# EAGLE design elysium_v0_8 (EAGLE 6.5.0)
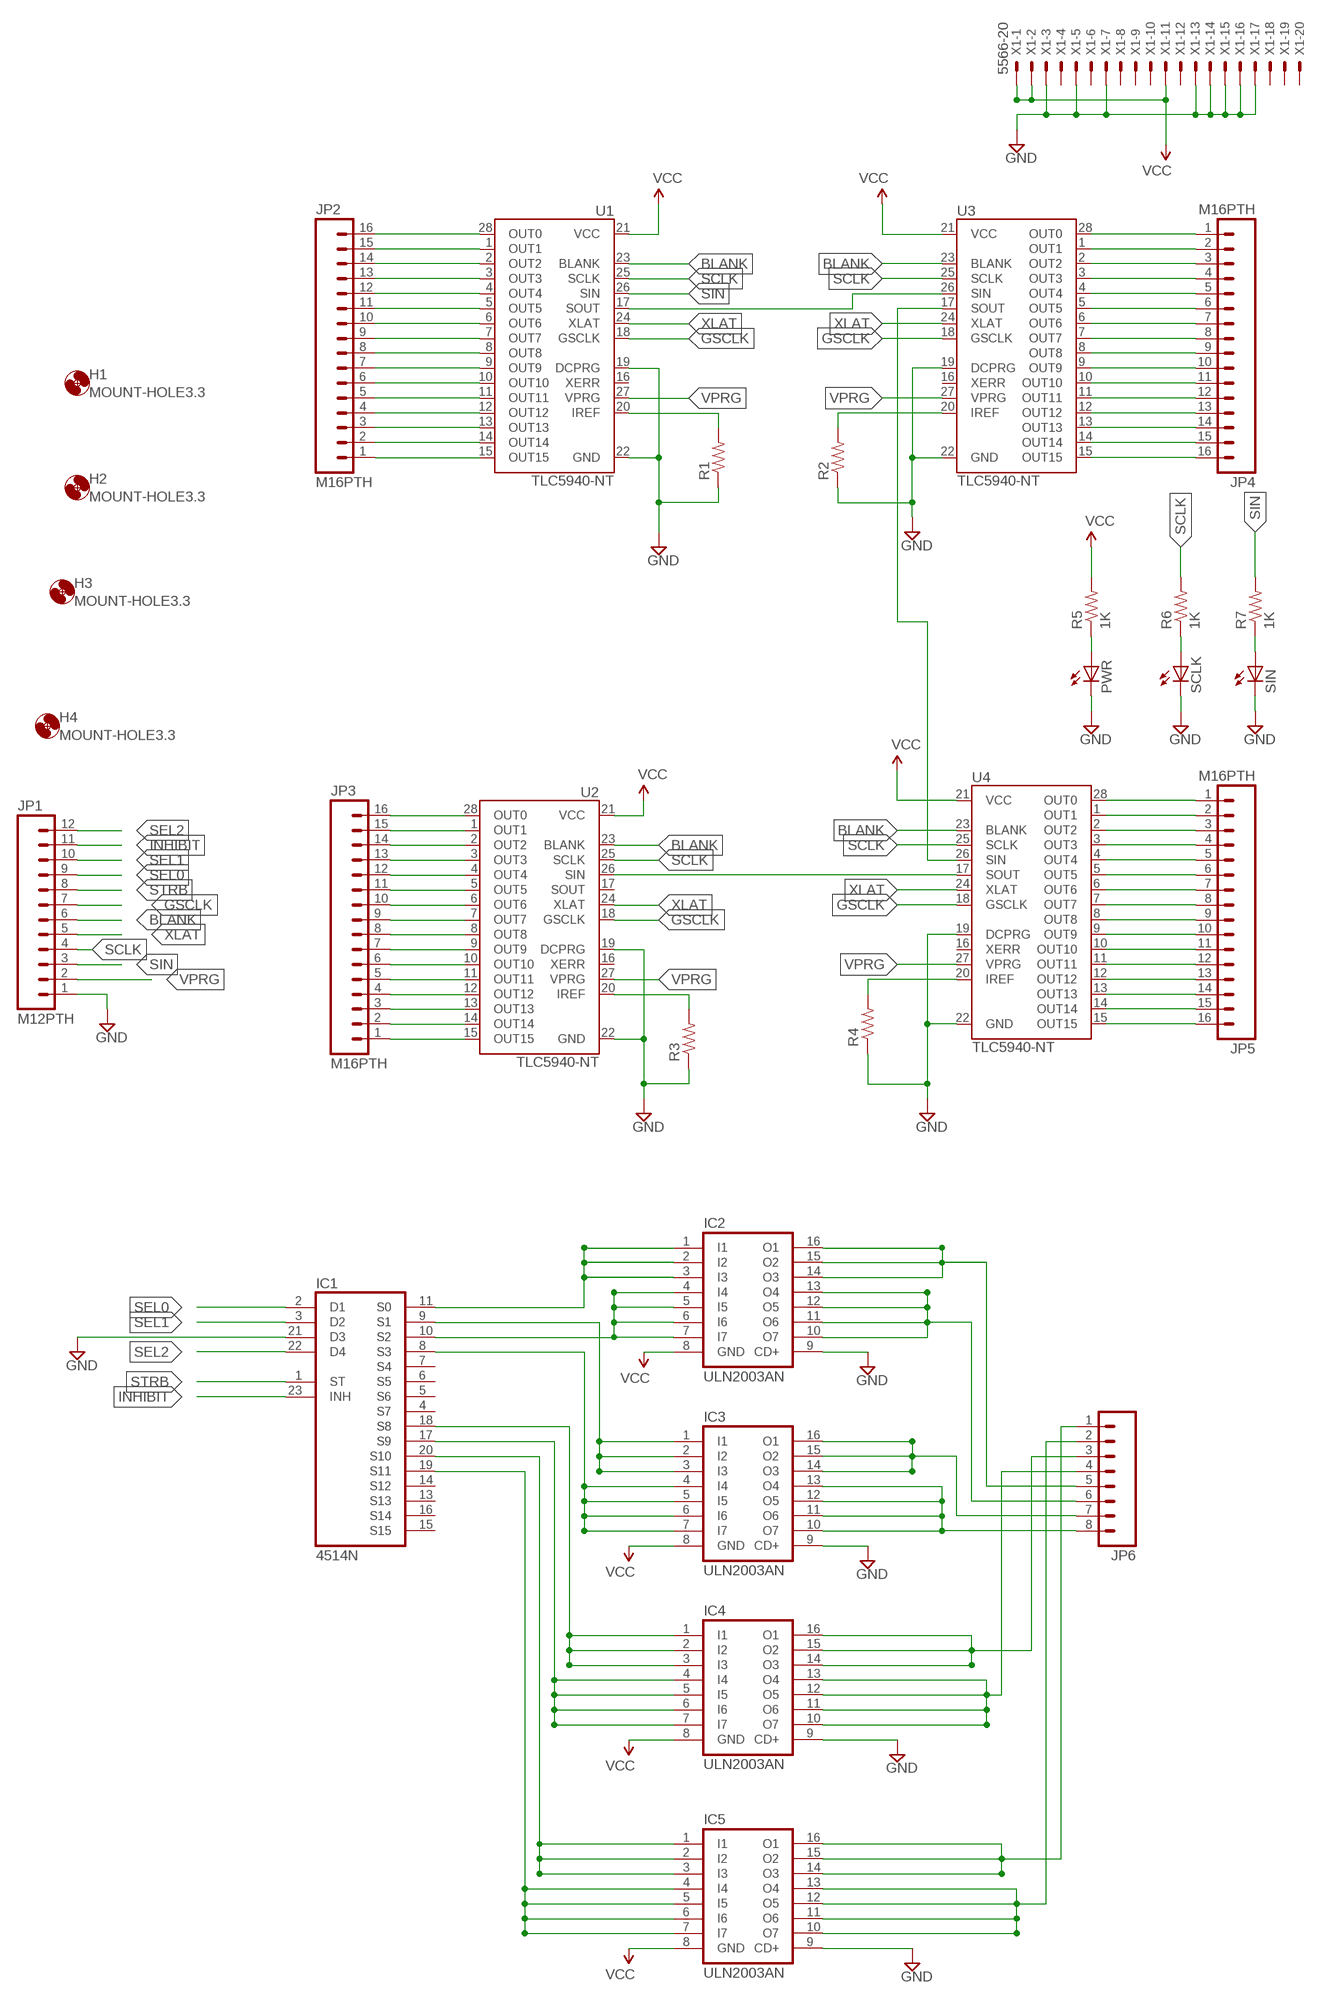
[diagram p0: schematic, sheet 1]

## Parts
H1  MOUNT-HOLE3.3  [3,3]
H2  MOUNT-HOLE3.3  [3,3]
H3  MOUNT-HOLE3.3  [3,3]
H4  MOUNT-HOLE3.3  [3,3]
IC1  4514N  [DIL24-6]
IC2  ULN2003AN  [DIL16]
IC3  ULN2003AN  [DIL16]
IC4  ULN2003AN  [DIL16]
IC5  ULN2003AN  [DIL16]
JP1  M12PTH  [1X12]
JP2  M16PTH  [1X16]
JP3  M16PTH  [1X16]
JP4  M16PTH  [1X16]
JP5  M16PTH  [1X16]
JP6  M081X08  [1X08]
PWR  LED5MM  [LED5MM]
R1  RESISTOREZ  [AXIAL-0.3EZ]
R2  RESISTOREZ  [AXIAL-0.3EZ]
R3  RESISTOREZ  [AXIAL-0.3EZ]
R4  RESISTOREZ  [AXIAL-0.3EZ]
R5  1K  RESISTOREZ  [AXIAL-0.3EZ]
R6  1K  RESISTOREZ  [AXIAL-0.3EZ]
R7  1K  RESISTOREZ  [AXIAL-0.3EZ]
SCLK  LED5MM  [LED5MM]
SIN  LED5MM  [LED5MM]
U1  TLC5940-NT  [DIL28-3]
U2  TLC5940-NT  [DIL28-3]
U3  TLC5940-NT  [DIL28-3]
U4  TLC5940-NT  [DIL28-3]
X1  5566-20  [5566-20]

## Nets
BLANK: JP1.6 U1.23(BLANK) U2.23(BLANK) U3.23(BLANK) U4.23(BLANK)
GND: IC1.21(D3) IC2.9(CD+) IC3.9(CD+) IC4.9(CD+) IC5.9(CD+) JP1.1 PWR.K(C) R1.P$1 R2.P$1 R3.P$1 R4.P$1 SCLK.K(C) SIN.K(C) U1.19(DCPRG) U1.22(GND) U2.19(DCPRG) U2.22(GND) U3.19(DCPRG) U3.22(GND) U4.19(DCPRG) U4.22(GND) X1.3 X1.5 X1.7 X1.13 X1.14 X1.15 X1.16 X1.17
GSCLK: JP1.7 U1.18(GSCLK) U2.18(GSCLK) U3.18(GSCLK) U4.18(GSCLK)
INHIBIT: IC1.23(INH) JP1.11
N$1: JP2.16 U1.28(OUT0)
N$2: JP2.15 U1.1(OUT1)
N$3: JP2.14 U1.2(OUT2)
N$4: JP2.13 U1.3(OUT3)
N$5: JP2.12 U1.4(OUT4)
N$6: JP2.11 U1.5(OUT5)
N$7: JP2.10 U1.6(OUT6)
N$8: JP2.9 U1.7(OUT7)
N$9: JP2.8 U1.8(OUT8)
N$10: JP2.7 U1.9(OUT9)
N$11: JP2.6 U1.10(OUT10)
N$12: JP2.5 U1.11(OUT11)
N$13: JP2.4 U1.12(OUT12)
N$14: JP2.3 U1.13(OUT13)
N$15: JP2.2 U1.14(OUT14)
N$16: JP2.1 U1.15(OUT15)
N$17: JP4.1 U3.28(OUT0)
N$18: JP4.2 U3.1(OUT1)
N$19: JP4.3 U3.2(OUT2)
N$20: JP4.4 U3.3(OUT3)
N$21: JP4.5 U3.4(OUT4)
N$22: JP4.6 U3.5(OUT5)
N$23: JP4.7 U3.6(OUT6)
N$24: JP4.8 U3.7(OUT7)
N$25: JP4.9 U3.8(OUT8)
N$26: JP4.10 U3.9(OUT9)
N$27: JP4.11 U3.10(OUT10)
N$28: JP4.12 U3.11(OUT11)
N$29: JP4.13 U3.12(OUT12)
N$30: JP4.14 U3.13(OUT13)
N$31: JP4.15 U3.14(OUT14)
N$32: JP4.16 U3.15(OUT15)
N$33: JP3.16 U2.28(OUT0)
N$34: JP3.15 U2.1(OUT1)
N$35: JP3.14 U2.2(OUT2)
N$36: JP3.13 U2.3(OUT3)
N$37: JP3.12 U2.4(OUT4)
N$38: JP3.11 U2.5(OUT5)
N$39: JP3.10 U2.6(OUT6)
N$40: JP3.9 U2.7(OUT7)
N$41: JP3.8 U2.8(OUT8)
N$42: JP3.7 U2.9(OUT9)
N$43: JP3.6 U2.10(OUT10)
N$44: JP3.5 U2.11(OUT11)
N$45: JP3.4 U2.12(OUT12)
N$46: JP3.3 U2.13(OUT13)
N$47: JP3.2 U2.14(OUT14)
N$48: JP3.1 U2.15(OUT15)
N$49: JP5.1 U4.28(OUT0)
N$50: JP5.2 U4.1(OUT1)
N$51: JP5.3 U4.2(OUT2)
N$52: JP5.4 U4.3(OUT3)
N$53: JP5.5 U4.4(OUT4)
N$54: JP5.6 U4.5(OUT5)
N$55: JP5.7 U4.6(OUT6)
N$56: JP5.8 U4.7(OUT7)
N$57: JP5.9 U4.8(OUT8)
N$58: JP5.10 U4.9(OUT9)
N$59: JP5.11 U4.10(OUT10)
N$60: JP5.12 U4.11(OUT11)
N$61: JP5.13 U4.12(OUT12)
N$62: JP5.14 U4.13(OUT13)
N$63: JP5.15 U4.14(OUT14)
N$64: JP5.16 U4.15(OUT15)
N$65: U1.17(SOUT) U3.26(SIN)
N$66: U3.17(SOUT) U4.26(SIN)
N$67: U2.26(SIN) U4.17(SOUT)
N$68: R1.P$2 U1.20(IREF)
N$69: PWR.A R5.P$1
N$70: R2.P$2 U3.20(IREF)
N$71: IC1.11(S0) IC2.1(I1) IC2.2(I2) IC2.3(I3)
N$73: IC1.9(S1) IC3.1(I1) IC3.2(I2) IC3.3(I3)
N$74: R6.P$1 SCLK.A
N$75: R3.P$2 U2.20(IREF)
N$76: R7.P$1 SIN.A
N$77: R4.P$2 U4.20(IREF)
N$78: IC1.10(S2) IC2.4(I4) IC2.5(I5) IC2.6(I6) IC2.7(I7)
N$79: IC1.8(S3) IC3.4(I4) IC3.5(I5) IC3.6(I6) IC3.7(I7)
N$80: IC1.18(S8) IC4.1(I1) IC4.2(I2) IC4.3(I3)
N$81: IC1.17(S9) IC4.4(I4) IC4.5(I5) IC4.6(I6) IC4.7(I7)
N$82: IC1.20(S10) IC5.1(I1) IC5.2(I2) IC5.3(I3)
N$83: IC1.19(S11) IC5.4(I4) IC5.5(I5) IC5.6(I6) IC5.7(I7)
N$84: IC2.14(O3) IC2.15(O2) IC2.16(O1) JP6.5
N$85: IC2.10(O7) IC2.11(O6) IC2.12(O5) IC2.13(O4) JP6.6
N$86: IC3.14(O3) IC3.15(O2) IC3.16(O1) JP6.7
N$87: IC3.10(O7) IC3.11(O6) IC3.12(O5) IC3.13(O4) JP6.8
N$88: IC4.14(O3) IC4.15(O2) IC4.16(O1) JP6.3
N$89: IC4.10(O7) IC4.11(O6) IC4.12(O5) IC4.13(O4) JP6.4
N$90: IC5.14(O3) IC5.15(O2) IC5.16(O1) JP6.1
N$91: IC5.10(O7) IC5.11(O6) IC5.12(O5) IC5.13(O4) JP6.2
SCLK: JP1.4 R6.P$2 U1.25(SCLK) U2.25(SCLK) U3.25(SCLK) U4.25(SCLK)
SEL0: IC1.2(D1) JP1.9
SEL1: IC1.3(D2) JP1.10
SEL2: IC1.22(D4) JP1.12
SIN: JP1.3 R7.P$2 U1.26(SIN)
STRB: IC1.1(ST) JP1.8
VCC: IC2.8(GND) IC3.8(GND) IC4.8(GND) IC5.8(GND) R5.P$2 U1.21(VCC) U2.21(VCC) U3.21(VCC) U4.21(VCC) X1.1 X1.2 X1.11
VPRG: JP1.2 U1.27(VPRG) U2.27(VPRG) U3.27(VPRG) U4.27(VPRG)
XLAT: JP1.5 U1.24(XLAT) U2.24(XLAT) U3.24(XLAT) U4.24(XLAT)
Unconnected: IC1.4(S7) IC1.5(S6) IC1.6(S5) IC1.7(S4) IC1.13(S13) IC1.14(S12) IC1.15(S15) IC1.16(S14) U1.16(XERR) U2.16(XERR) U2.17(SOUT) U3.16(XERR) U4.16(XERR) X1.4 X1.6 X1.8 X1.9 X1.10 X1.12 X1.18 X1.19 X1.20

## Power pins joined to a net without a drawn wire
GND: IC1.12(VSS)
VCC: IC1.24(VDD)

## Library data of the parts
H1-H4 = holes:MOUNT-HOLE: MOUNTING HOLE with drill center marker
IC1 = 45xx:4514: 4-bit latch 4-16 line DECODER
IC2-IC5 = uln-udn:ULN2003A: DRIVER ARRAY
JP1 = SparkFun-Connectors:M12: Header 12 Standard 12-pin 0.1" header. Use with straight break away headers (SKU : PRT-00116), right angle break away headers (PRT-00553), swiss pins (PRT-00743), machine pins (PRT-00117), and female headers (PRT-00115).
JP2-JP5 = SparkFun-Connectors:M16: 1x16 .1" header
JP6 = SparkFun-Connectors:M08: Header 8 Standard 8-pin 0.1" header. Use with straight break away headers (SKU : PRT-00116), right angle break away headers (PRT-00553), swiss pins (PRT-00743), machine pins (PRT-00117), and female headers (PRT-00115).
PWR SCLK SIN = adafruit:LED: LED OSRAM: - CHIPLED LG R971, LG N971, LY N971, LG Q971, LY Q971, LO R971, LY R971 LH N974, LH R974 LS Q976, LO Q976, LY Q976 LO Q996 - Hyper CHIPLED LW Q18S LB Q993, LB Q99A, LB R99A - SideLED LS A670, LO A670, LY A670, LG A670, LP A670 LB A673, LV A673, LT A673, LW A673 LH A674 LY A675 LS A676, LA A676, LO A676, LY A676, LW A676 LS A679, LY A679, LG A679 - Hyper Micro SIDELED® LS Y876, LA Y876, LO Y876, LY Y876 LT Y87S - SmartLED LW L88C, LW L88S LB L89C, LB L89S, LG L890 LS L89K, LO L89K, LY L89K LS L896, LA L896, LO L896, LY L896 - TOPLED LS T670, LO T670, LY T670, LG T670, LP T670 LSG T670, LSP T670, LSY T670, LOP T670, LYG T670 LG T671, LOG T671, LSG T671 LB T673, LV T673, LT T673, LW T673 LH T674 LS T676, LA T676, LO T676, LY T676, LB T676, LH T676, LSB T676, LW T676 LB T67C, LV T67C, LT T67C, LS T67K, LO T67K, LY T67K, LW E67C LS E67B, LA E67B, LO E67B, LY E67B, LB E67C, LV E67C, LT E67C LW T67C LS T679, LY T679, LG T679 LS T770, LO T770, LY T770, LG T770, LP T770 LB T773, LV T773, LT T773, LW T773 LH T774 LS E675, LA E675, LY E675, LS T675 LS T776, LA T776, LO T776, LY T776, LB T776 LHGB T686 LT T68C, LB T68C - Hyper Mini TOPLED® LB M676 - Mini TOPLED Santana® LG M470 LS M47K, LO M47K, LY M47K Source: http://www.osram.convergy.de/
R1-R7 = SparkFun-Resistors:RESISTOR: Resistor Basic schematic elements and footprints for 0603, 1206, and PTH resistors.
U1-U4 = SparkFun-DigitalIC:TLC5940: 16-channel LED Driver with Dot Correction and Grayscale PWM Control The TLC5940 is a 16-channel, constant-current sink LED driver. Each channel has an individually adjustable 4096-step grayscale PWM brightness control and a 64-step, constant-current sink (dot correction). The dot correction adjusts the brightness variations between LED channels and other LED drivers. The dot correction data is stored in an integrated EEPROM. Both grayscale control and dot correction are accessible via a serial interface. A single external resistor sets the maximum current value of all 16 channels. Packages: 28-pin HTSSOP 32-pin 5x5mm QFN 28-pin DIP
X1 = con-molex:5566-20: Mini FIT connector 20 pol ATX PC-Motherboard Power connector Source: http://www.molex.com; OC_FARNELL: unknown; OC_NEWARK: unknown

## Board
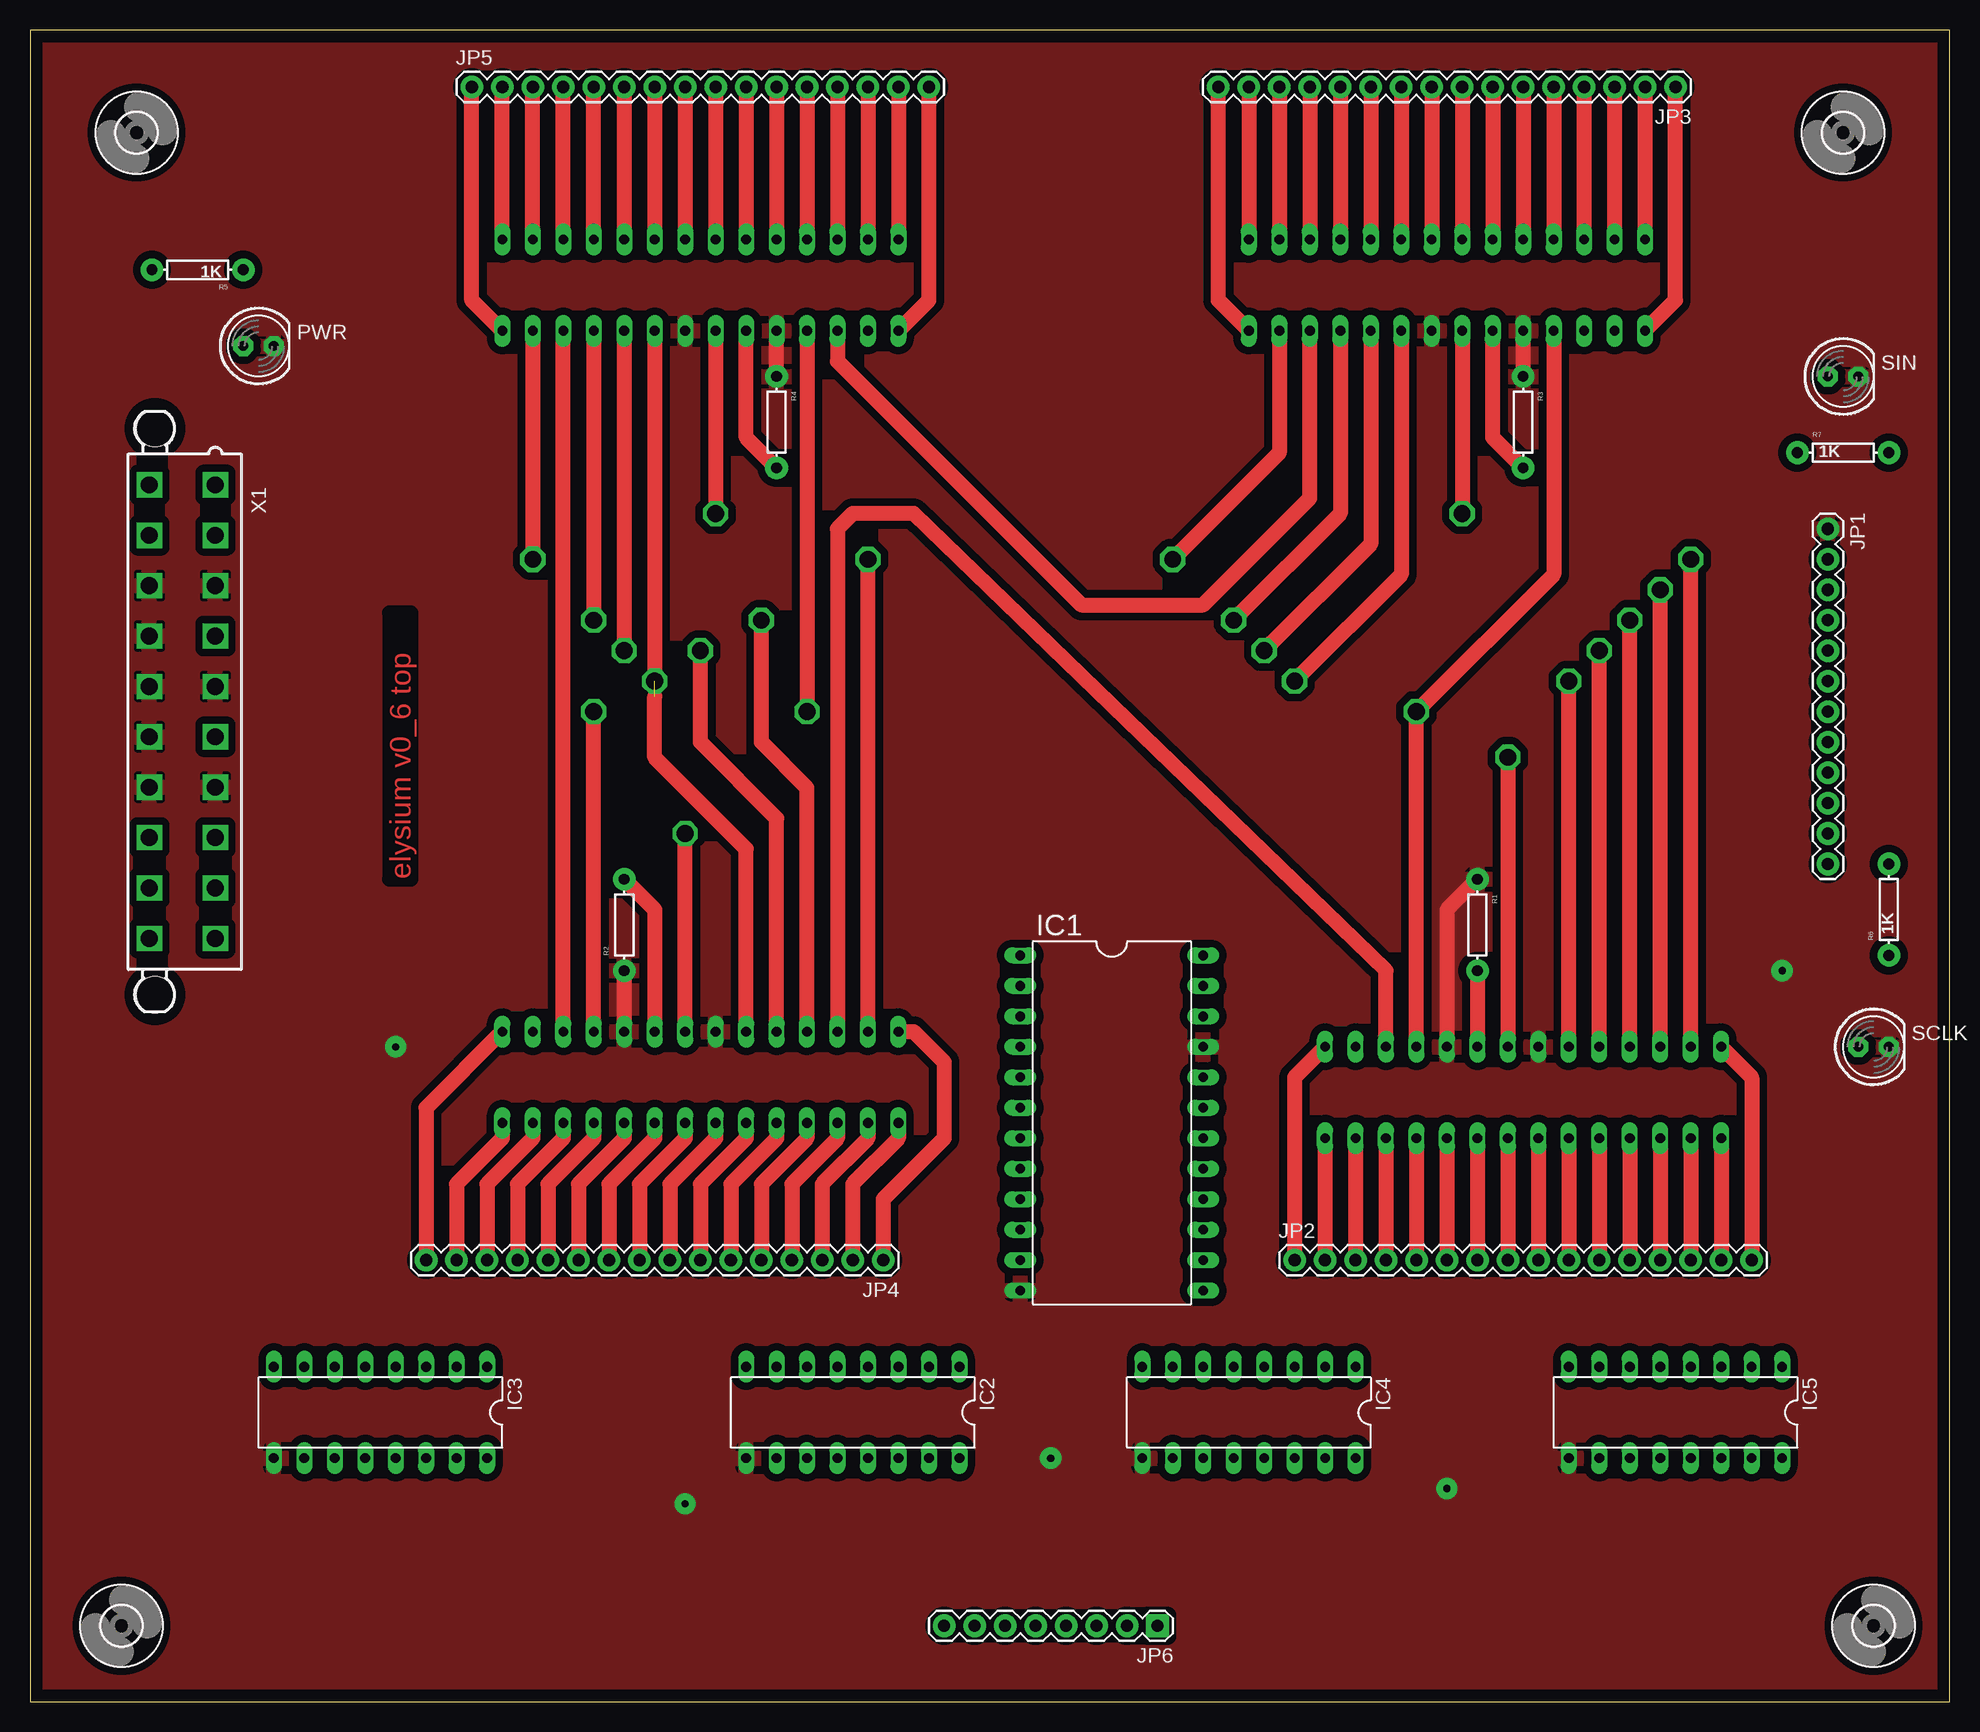
[diagram p1: board, top side]
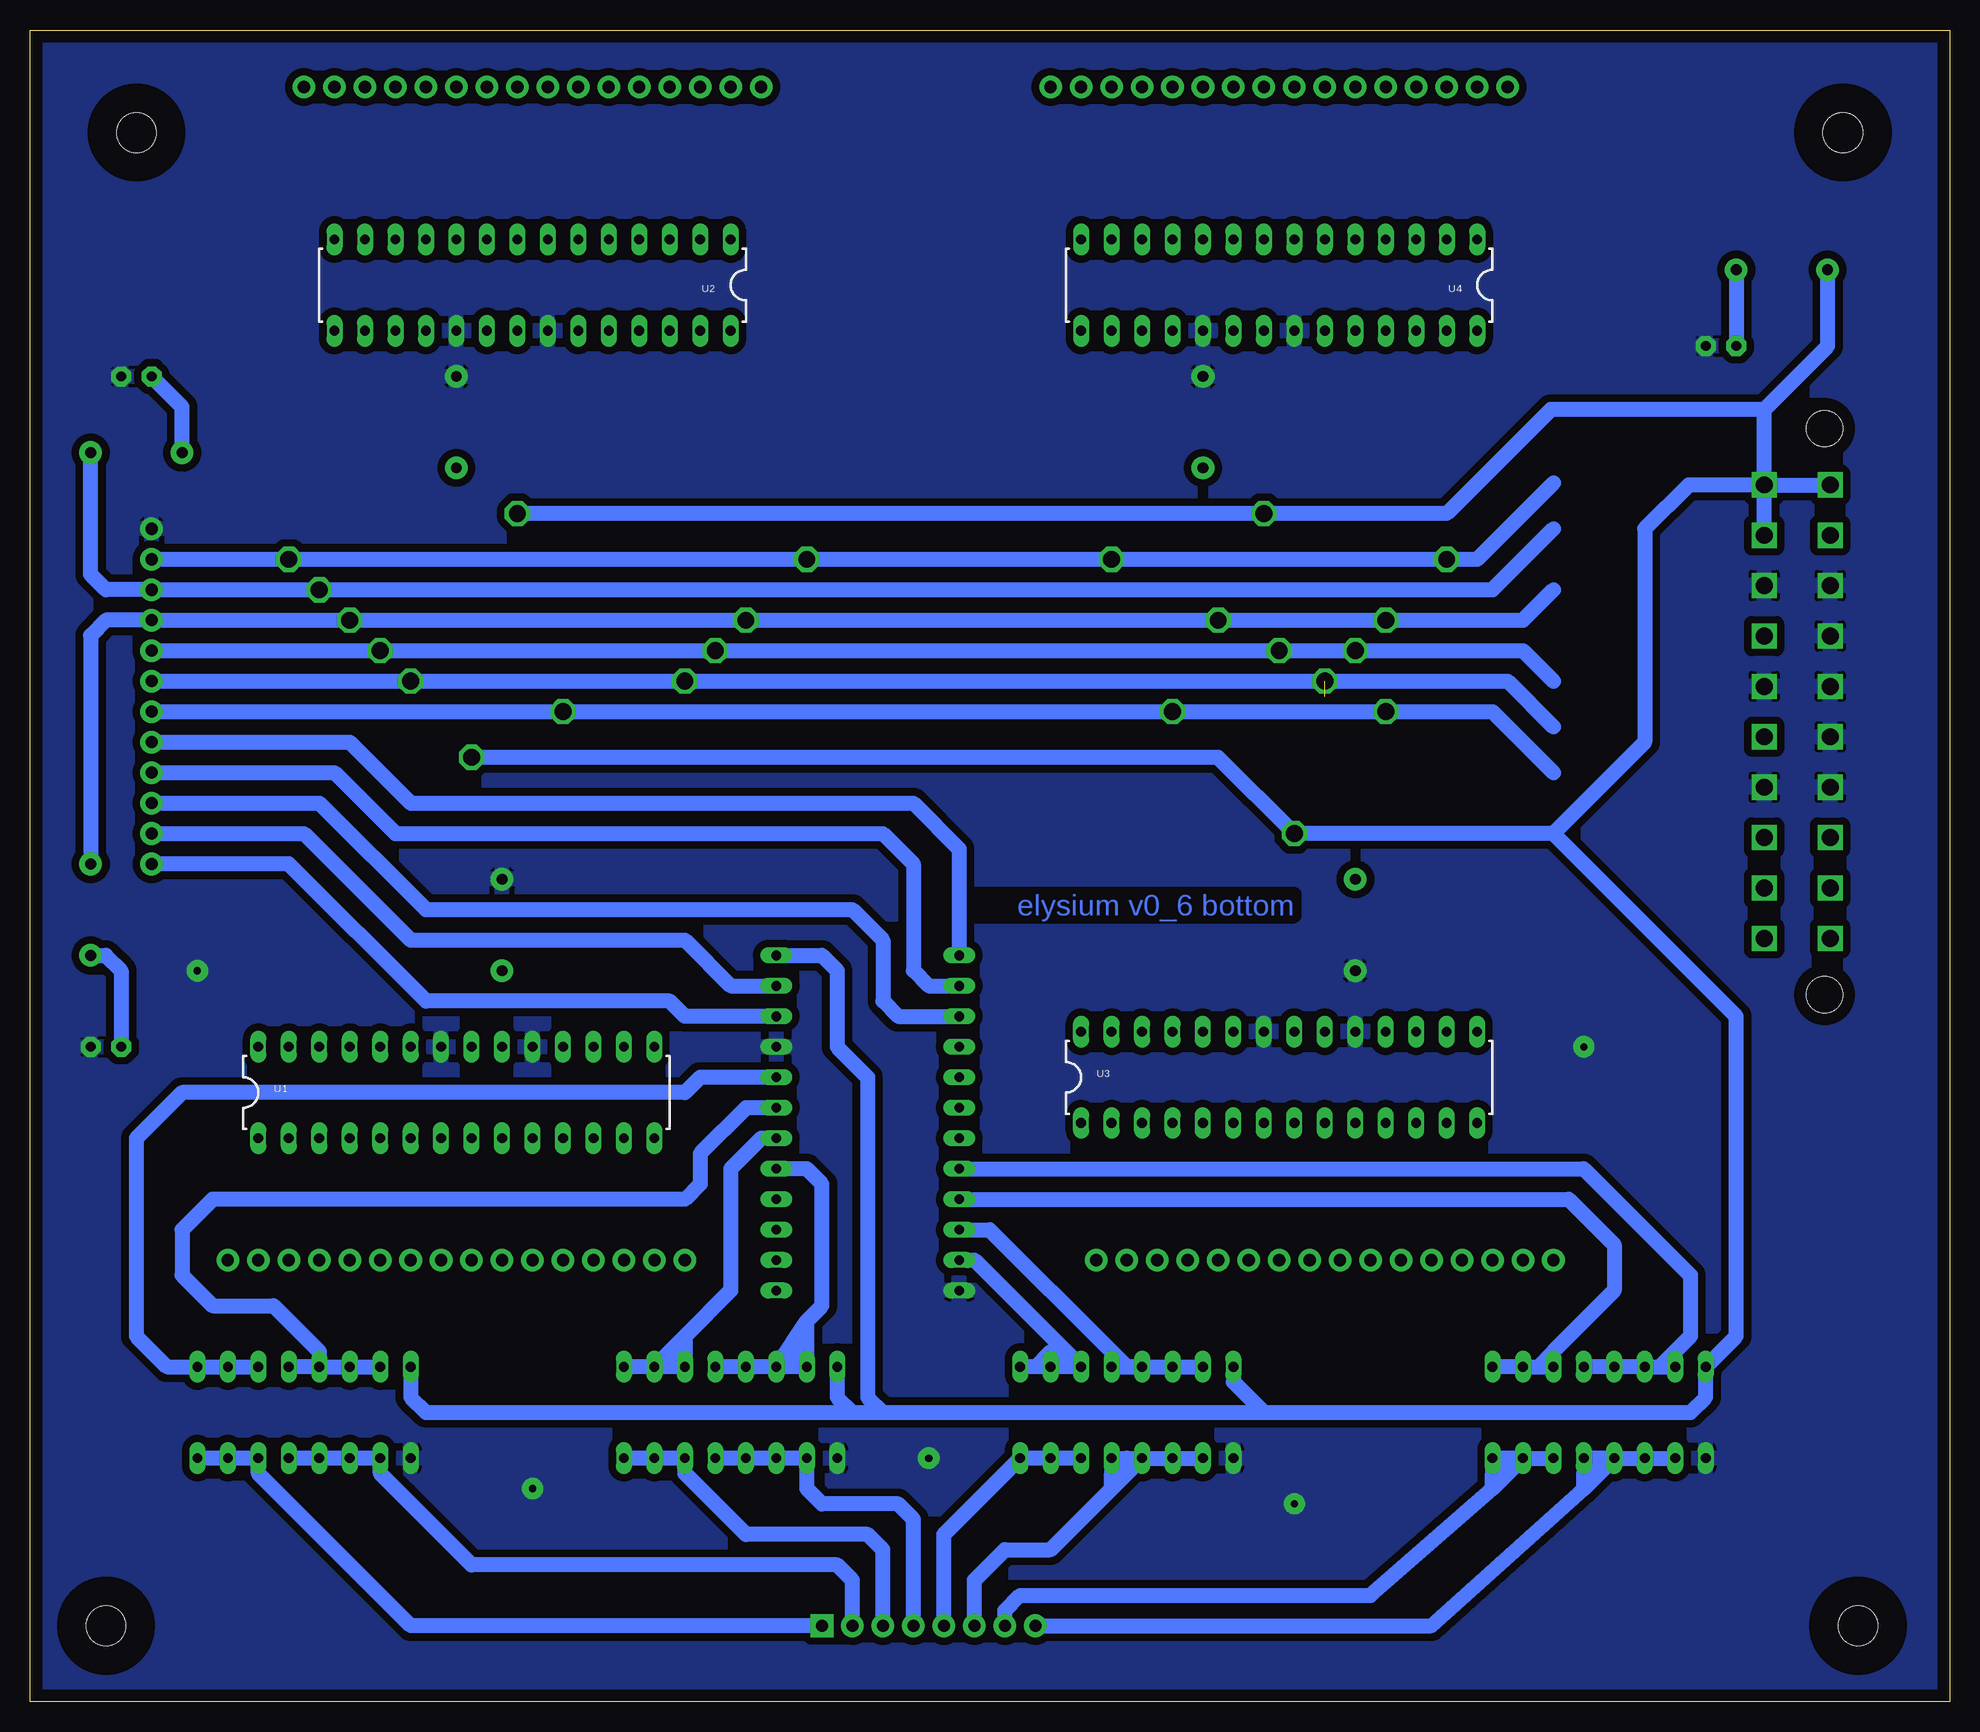
[diagram p2: board, bottom side, seen from below]

Size 160 x 139.37 mm. Coordinates in mm from the lower left corner, seen from the top.
Outline: 0,0 160,0 160,139.37 0,139.37 0,0
Copper layers (1*16): Top 0.035mm / dielectric 1.5mm / Bottom 0.035mm
Design rules "default *": minimum track width 24mil, minimum drill 24mil, track to track 25mil, track to pad 25mil, pad to pad 25mil, via to via 25mil, smd to smd 8mil, copper to edge 40mil, drill to drill 8mil, minimum pad ring 10mil, minimum via ring 8mil, stop-mask expansion 4mil, vias tented up to drill 0mil, thermal gap 10mil

### Footprints (pad centres in the part's own frame; a part is rotated, then mirrored left to right if it is on the bottom)
3,3 = hole 3.3: 0,0
DIL24-6 = drill 0.813 long: 1 -13.97,-7.62; 2 -11.43,-7.62; 3 -8.89,-7.62; 4 -6.35,-7.62; 5 -3.81,-7.62; 6 -1.27,-7.62; 7 1.27,-7.62; 8 3.81,-7.62; 9 6.35,-7.62; 10 8.89,-7.62; 11 11.43,-7.62; 12 13.97,-7.62; 13 13.97,7.62; 14 11.43,7.62; 15 8.89,7.62; 16 6.35,7.62; 17 3.81,7.62; 18 1.27,7.62; 19 -1.27,7.62; 20 -3.81,7.62; 21 -6.35,7.62; 22 -8.89,7.62; 23 -11.43,7.62; 24 -13.97,7.62
DIL16 = drill 0.813 long: 1 -8.89,-3.81; 2 -6.35,-3.81; 3 -3.81,-3.81; 4 -1.27,-3.81; 5 1.27,-3.81; 6 3.81,-3.81; 7 6.35,-3.81; 8 8.89,-3.81; 9 8.89,3.81; 10 6.35,3.81; 11 3.81,3.81; 12 1.27,3.81; 13 -1.27,3.81; 14 -3.81,3.81; 15 -6.35,3.81; 16 -8.89,3.81
1X12 = drill 1.016 pad 1.88: 1 0,0; 2 2.54,0; 3 5.08,0; 4 7.62,0; 5 10.16,0; 6 12.7,0; 7 15.24,0; 8 17.78,0; 9 20.32,0; 10 22.86,0; 11 25.4,0; 12 27.94,0
1X16 = drill 1.016 pad 1.88: 1 0,0; 2 2.54,0; 3 5.08,0; 4 7.62,0; 5 10.16,0; 6 12.7,0; 7 15.24,0; 8 17.78,0; 9 20.32,0; 10 22.86,0; 11 25.4,0; 12 27.94,0; 13 30.48,0; 14 33.02,0; 15 35.56,0; 16 38.1,0
1X08 = drill 1.016 pad 1.88 square: 1 0,0 | drill 1.016 pad 1.88: 2 2.54,0; 3 5.08,0; 4 7.62,0; 5 10.16,0; 6 12.7,0; 7 15.24,0; 8 17.78,0
LED5MM = drill 0.813 pad 1.676 octagon: A -1.27,0; K 1.27,0
AXIAL-0.3EZ = drill 0.9 pad 1.88: P$1 -3.81,0; P$2 3.81,0
DIL28-3 = drill 0.813 long: 1 -16.51,-3.81; 2 -13.97,-3.81; 3 -11.43,-3.81; 4 -8.89,-3.81; 5 -6.35,-3.81; 6 -3.81,-3.81; 7 -1.27,-3.81; 8 1.27,-3.81; 9 3.81,-3.81; 10 6.35,-3.81; 11 8.89,-3.81; 12 11.43,-3.81; 13 13.97,-3.81; 14 16.51,-3.81; 15 16.51,3.81; 16 13.97,3.81; 17 11.43,3.81; 18 8.89,3.81; 19 6.35,3.81; 20 3.81,3.81; 21 1.27,3.81; 22 -1.27,3.81; 23 -3.81,3.81; 24 -6.35,3.81; 25 -8.89,3.81; 26 -11.43,3.81; 27 -13.97,3.81; 28 -16.51,3.81
5566-20 = drill 1.4 square: 1 18.9,-2.75; 2 14.7,-2.75; 3 10.5,-2.75; 4 6.3,-2.75; 5 2.1,-2.75; 6 -2.1,-2.75; 7 -6.3,-2.75; 8 -10.5,-2.75; 9 -14.7,-2.75; 10 -18.9,-2.75; 11 18.9,2.75; 12 14.7,2.75; 13 10.5,2.75; 14 6.3,2.75; 15 2.1,2.75; 16 -2.1,2.75; 17 -6.3,2.75; 18 -10.5,2.75; 19 -14.7,2.75; 20 -18.9,2.75 | hole 3: 23.6,2.29; -23.6,2.29

### Placement (x,y rotation side)
H1  8.89,130.81 0 top
H2  7.62,6.35 0 top
H3  151.13,130.81 0 top
H4  153.67,6.35 0 top
IC1  90.17,48.26 270 top
IC2  68.58,24.13 180 top
IC3  29.21,24.13 180 top
IC4  101.6,24.13 180 top
IC5  137.16,24.13 180 top
JP1  149.86,97.79 270 top
JP2  105.41,36.83 0 top
JP3  137.16,134.62 180 top
JP4  71.12,36.83 180 top
JP5  36.83,134.62 0 top
JP6  93.98,6.35 180 top
PWR  19.05,113.03 0 top
R1  120.65,64.77 270 top
R2  49.53,64.77 90 top
R3  124.46,106.68 270 top
R4  62.23,106.68 270 top
R5  13.97,119.38 180 top
R6  154.94,66.04 90 top
R7  151.13,104.14 0 top
SCLK  153.67,54.61 0 top
SIN  151.13,110.49 0 top
U1  124.46,50.8 0 bottom
U2  118.11,118.11 180 bottom
U3  55.88,52.07 0 bottom
U4  55.88,118.11 180 bottom
X1  12.7,82.55 90 top

### Tracks (layer width: path | path; a pad name or v marks a point on that pad's centre or on a via)
BLANK  (via drill 1.4)  (1 unrouted)
  Top 1.27: U4.23 v52.07,85.09 | U3.23 59.69,71.12 52.07,78.74 52.07,83.82 | U1.23 v128.27,85.09 | U2.23 114.3,93.98 v105.41,85.09
  Bottom 1.27: 33.02,81.28 36.83,85.09 v52.07,85.09 v105.41,85.09 v128.27,85.09 JP1.6
GND  (via drill 0.6 pad 1.78)
  Top 1.27: R4.P$1 U4.19 | R3.P$1 U2.19 | R2.P$1 U3.19 | R1.P$1 118.11,66.04 U1.19
  other vias: 30.48,54.61 146.05,60.96 54.61,16.51 85.09,20.32 118.11,17.78
  pour Top: -8.89,142.24 -5.08,-3.81 -3.81,-5.08 160.02,-7.62 170.18,-7.62 166.37,137.16 160.02,143.51 -7.62,143.51
  pour Bottom: -13.97,146.05 -16.51,-10.16 176.53,-12.7 173.99,27.94 173.99,137.16 162.56,148.59 -11.43,148.59
GSCLK  (via drill 1.4)
  Top 1.27: U4.18 v64.77,82.55 | U3.18 v46.99,82.55 | U1.18 v115.57,82.55 127,93.98 U2.18
  Bottom 1.27: 33.02,77.47 38.1,82.55 v46.99,82.55 v64.77,82.55 v115.57,82.55 JP1.7
INHIBIT
  Bottom 1.27: JP1.11 137.16,72.39 128.27,63.5 105.41,63.5 101.6,59.69 IC1.23
N$1
  Top 1.27: U1.28 143.51,52.07 JP2.16
N$2
  Top 1.27: U1.1 JP2.15
N$3
  Top 1.27: U1.2 JP2.14
N$4
  Top 1.27: U1.3 JP2.13
N$5
  Top 1.27: U1.4 JP2.12
N$6
  Top 1.27: U1.5 JP2.11
N$7
  Top 1.27: U1.6 JP2.10
N$8
  Top 1.27: U1.7 JP2.9
N$9
  Top 1.27: U1.8 JP2.8
N$10
  Top 1.27: U1.9 JP2.7
N$11
  Top 1.27: U1.10 JP2.6
N$12
  Top 1.27: U1.11 JP2.5
N$13
  Top 1.27: U1.12 JP2.4
N$14
  Top 1.27: U1.13 JP2.3
N$15
  Top 1.27: U1.14 JP2.2
N$16
  Top 1.27: U1.15 105.41,52.07 JP2.1
N$17
  Top 1.27: U3.28 73.66,55.88 76.2,53.34 76.2,46.99 71.12,41.91 JP4.1
N$18
  Top 1.27: U3.1 72.39,46.99 68.58,43.18 JP4.2
N$19
  Top 1.27: U3.2 69.85,46.99 66.04,43.18 JP4.3
N$20
  Top 1.27: U3.3 67.31,46.99 63.5,43.18 JP4.4
N$21
  Top 1.27: U3.4 64.77,46.99 60.96,43.18 JP4.5
N$22
  Top 1.27: U3.5 62.23,46.99 58.42,43.18 JP4.6
N$23
  Top 1.27: U3.6 59.69,46.99 55.88,43.18 JP4.7
N$24
  Top 1.27: U3.7 57.15,46.99 53.34,43.18 JP4.8
N$25
  Top 1.27: U3.8 54.61,46.99 50.8,43.18 JP4.9
N$26
  Top 1.27: U3.9 52.07,46.99 48.26,43.18 JP4.10
N$27
  Top 1.27: U3.10 49.53,46.99 45.72,43.18 JP4.11
N$28
  Top 1.27: U3.11 46.99,46.99 43.18,43.18 JP4.12
N$29
  Top 1.27: U3.12 44.45,46.99 40.64,43.18 JP4.13
N$30
  Top 1.27: U3.13 41.91,46.99 38.1,43.18 JP4.14
N$31
  Top 1.27: U3.14 39.37,46.99 35.56,43.18 JP4.15
N$32
  Top 1.27: U3.15 33.02,49.53 JP4.16
N$33
  Top 1.27: U2.28 99.06,116.84 JP3.16
N$34
  Top 1.27: JP3.15 U2.1
N$35
  Top 1.27: JP3.14 U2.2
N$36
  Top 1.27: JP3.13 U2.3
N$37
  Top 1.27: JP3.12 U2.4
N$38
  Top 1.27: JP3.11 U2.5
N$39
  Top 1.27: JP3.10 U2.6
N$40
  Top 1.27: JP3.9 U2.7
N$41
  Top 1.27: JP3.8 U2.8
N$42
  Top 1.27: JP3.7 U2.9
N$43
  Top 1.27: JP3.6 U2.10
N$44
  Top 1.27: JP3.5 U2.11
N$45
  Top 1.27: JP3.4 U2.12
N$46
  Top 1.27: JP3.3 U2.13
N$47
  Top 1.27: JP3.2 U2.14
N$48
  Top 1.27: U2.15 137.16,116.84 JP3.1
N$49
  Top 1.27: U4.28 36.83,116.84 JP5.1
N$50
  Top 1.27: U4.1 JP5.2
N$51
  Top 1.27: U4.2 JP5.3
N$52
  Top 1.27: U4.3 JP5.4
N$53
  Top 1.27: U4.4 JP5.5
N$54
  Top 1.27: JP5.6 U4.5
N$55
  Top 1.27: JP5.7 U4.6
N$56
  Top 1.27: JP5.8 U4.7
N$57
  Top 1.27: JP5.9 U4.8
N$58
  Top 1.27: JP5.10 U4.9
N$59
  Top 1.27: JP5.11 U4.10
N$60
  Top 1.27: JP5.12 U4.11
N$61
  Top 1.27: JP5.13 U4.12
N$62
  Top 1.27: JP5.14 U4.13
N$63
  Top 1.27: JP5.15 U4.14
N$64
  Top 1.27: U4.15 74.93,116.84 JP5.16
N$65
  Top 1.27: U1.17 113.03,60.96 73.66,99.06 68.58,99.06 67.31,97.79 U3.26
N$66
  Top 1.27: U3.17 U4.26
N$67
  Top 1.27: U4.17 67.31,111.76 87.63,91.44 97.79,91.44 106.68,100.33 U2.26
N$68
  Top 1.27: R1.P$2 U1.20
N$69
  Bottom 1.27: R5.P$1 PWR.A
N$70
  Top 1.27: R2.P$2 52.07,66.04 U3.20
N$71
  Bottom 1.27: IC1.11 81.28,36.83 73.66,29.21 | 73.66,29.21 IC2.3 IC2.2 | IC2.2 76.2,27.94 | 76.2,27.94 IC2.1 | IC2.2 73.66,29.21 | 73.66,29.21 74.93,29.21 76.2,27.94
N$73
  Bottom 1.27: IC1.9 31.75,41.91 27.94,38.1 27.94,34.29 33.02,29.21 | IC3.1 IC3.2 34.29,27.94 | 34.29,27.94 IC3.3 33.02,29.21 | 33.02,29.21 34.29,27.94
N$74
  Bottom 1.27: R6.P$1 153.67,62.23 152.4,60.96 SCLK.A
N$75
  Top 1.27: R3.P$2 121.92,105.41 U2.20
N$76
  Bottom 1.27: R7.P$1 147.32,107.95 SIN.A
N$77
  Top 1.27: R4.P$2 59.69,105.41 U4.20
N$78
  Bottom 1.27: 69.85,29.21 IC2.4 IC2.5 | IC2.5 IC2.6 IC2.7 | IC2.5 68.58,27.94 69.85,29.21 | IC1.10 80.01,39.37 69.85,29.21
N$79
  Bottom 1.27: IC1.8 30.48,44.45 21.59,35.56 21.59,30.48 22.86,29.21 | IC3.4 IC3.5 IC3.6 24.13,27.94 | 24.13,27.94 IC3.7 22.86,29.21 | 22.86,29.21 24.13,27.94
N$80
  Bottom 1.27: IC1.18 99.06,46.99 101.6,44.45 101.6,34.29 105.41,30.48 | 105.41,30.48 105.41,29.21 | 105.41,29.21 IC4.3 106.68,27.94 | 106.68,27.94 IC4.2 | IC4.2 IC4.1 | IC4.2 105.41,30.48 | 105.41,29.21 106.68,27.94
N$81
  Bottom 1.27: IC4.7 95.25,30.48 | 95.25,30.48 95.25,31.75 | 95.25,31.75 93.98,33.02 93.98,43.18 95.25,44.45 IC1.17 | IC4.7 96.52,29.21 | IC4.6 IC4.5 IC4.4 | 95.25,30.48 96.52,29.21 | 96.52,29.21 IC4.6 | IC4.6 95.25,31.75 | IC4.7 IC4.6
N$82
  Bottom 1.27: IC1.20 104.14,52.07 105.41,50.8 147.32,50.8 151.13,46.99 151.13,30.48 148.59,27.94 IC5.1 IC5.2 IC5.3
N$83
  Bottom 1.27: IC1.19 100.33,49.53 104.14,45.72 104.14,43.18 105.41,41.91 144.78,41.91 147.32,39.37 147.32,35.56 144.78,33.02 139.7,33.02 135.89,29.21 IC5.5 | IC5.5 IC5.4 | IC5.5 IC5.6 IC5.7
N$84
  Bottom 1.27: IC2.14 IC2.15 IC2.16 83.82,13.97 JP6.5
N$85
  Bottom 1.27: 69.85,17.78 IC2.12 | IC2.12 IC2.11 IC2.10 | 68.58,20.32 IC2.13 69.85,19.05 | 68.58,20.32 IC2.12 | 69.85,17.78 69.85,19.05 | 69.85,19.05 68.58,20.32 | JP6.6 81.28,10.16 78.74,12.7 74.93,12.7 69.85,17.78
N$86
  Bottom 1.27: JP6.7 78.74,7.62 77.47,8.89 48.26,8.89 38.1,17.78 | 38.1,17.78 IC3.15 | IC3.15 IC3.14 | IC3.15 36.83,20.32 | 36.83,20.32 IC3.16 38.1,19.05 | 38.1,17.78 38.1,19.05 | 38.1,19.05 36.83,20.32
N$87
  Bottom 1.27: JP6.8 43.18,6.35 30.48,17.78 | 30.48,17.78 IC3.12 | IC3.12 IC3.11 IC3.10 | IC3.12 29.21,20.32 | 29.21,20.32 IC3.13 30.48,19.05 | 30.48,17.78 30.48,19.05 | 30.48,19.05 29.21,20.32
N$88
  Bottom 1.27: JP6.3 88.9,12.7 90.17,13.97 100.33,13.97 105.41,19.05 IC4.14 IC4.15 IC4.16
N$89
  Bottom 1.27: JP6.4 86.36,15.24 87.63,16.51 93.98,16.51 95.25,17.78 IC4.10 IC4.11 IC4.12 IC4.13
N$90
  Bottom 1.27: JP6.1 128.27,6.35 140.97,19.05 IC5.14 IC5.15 IC5.16
N$91
  Bottom 1.27: JP6.2 91.44,10.16 92.71,11.43 123.19,11.43 130.81,19.05 IC5.10 IC5.11 IC5.12 IC5.13
SCLK  (via drill 1.4)
  Top 1.27: U4.25 v46.99,90.17 | U3.25 64.77,76.2 60.96,80.01 v60.96,90.17 | U1.25 v133.35,90.17 | U2.25 109.22,99.06 v100.33,90.17
  Bottom 1.27: 33.02,92.71 35.56,90.17 v46.99,90.17 v60.96,90.17 v100.33,90.17 v133.35,90.17 JP1.4 153.67,90.17 154.94,88.9 R6.P$2
SEL0
  Bottom 1.27: JP1.9 134.62,77.47 129.54,72.39 88.9,72.39 86.36,69.85 86.36,60.96 85.09,59.69 IC1.2
SEL1
  Bottom 1.27: JP1.10 135.89,74.93 127,66.04 91.44,66.04 88.9,63.5 88.9,58.42 87.63,57.15 IC1.3
SEL2
  Bottom 1.27: IC1.22 105.41,57.15 106.68,58.42 127,58.42 138.43,69.85 JP1.12
SIN  (via drill 1.4)
  Top 1.27: U1.26 v135.89,92.71
  Bottom 1.27: 33.02,97.79 38.1,92.71 v135.89,92.71 JP1.3 153.67,92.71 154.94,93.98 R7.P$2
STRB
  Bottom 1.27: JP1.8 133.35,80.01 128.27,74.93 86.36,74.93 82.55,71.12 IC1.1
VCC  (via drill 1.4)
  Top 1.27: U4.21 v57.15,99.06 | U2.21 v119.38,99.06 | v123.19,78.74 U1.21 | U3.21 v54.61,72.39
  Bottom 1.27: 15.45,107.74 10.16,113.03 R5.P$2 | v119.38,99.06 v57.15,99.06 41.91,99.06 33.23,107.74 15.45,107.74 | X1.1 21.74,101.45 25.4,97.79 25.4,80.01 33.02,72.39 | 33.02,72.39 v54.61,72.39 60.96,78.74 v123.19,78.74 | 33.02,72.39 17.78,57.15 17.78,30.48 IC3.8 20.32,25.4 21.59,24.13 57.15,24.13 | IC2.8 59.69,26.67 57.15,24.13 | IC4.8 92.71,25.4 91.44,24.13 | 91.44,24.13 88.9,24.13 | 88.9,24.13 57.15,24.13 | IC1.24 93.98,62.23 92.71,60.96 92.71,54.61 90.17,52.07 90.17,25.4 88.9,24.13 | IC5.8 128.27,25.4 127,24.13 91.44,24.13 | X1.1 15.45,107.74 | X1.2 X1.1 | X1.1 X1.11
VPRG  (via drill 1.4)
  Top 1.27: U4.27 v41.91,95.25 | U3.27 v69.85,95.25 | U1.27 v138.43,95.25 | U2.27 104.14,104.14 v95.25,95.25
  Bottom 1.27: 33.02,101.6 39.37,95.25 v41.91,95.25 v69.85,95.25 v95.25,95.25 v138.43,95.25 JP1.2
XLAT  (via drill 1.4)
  Top 1.27: U4.24 v49.53,87.63 | U3.24 62.23,73.66 55.88,80.01 v55.88,87.63 | U1.24 v130.81,87.63 | U2.24 111.76,96.52 v102.87,87.63
  Bottom 1.27: 33.02,85.09 35.56,87.63 v49.53,87.63 v55.88,87.63 v102.87,87.63 v130.81,87.63 JP1.5

### Text on the board
Top: elysium v0_6 top
Bottom: elysium v0_6 bottom